# Altium schematic sheet Sheet1.SchDoc
size 209 x 297 mm; Scale: 1:1; DocumentType: Схема электрическая принципиальная; FirstReferrence: АБВГ.123456.001
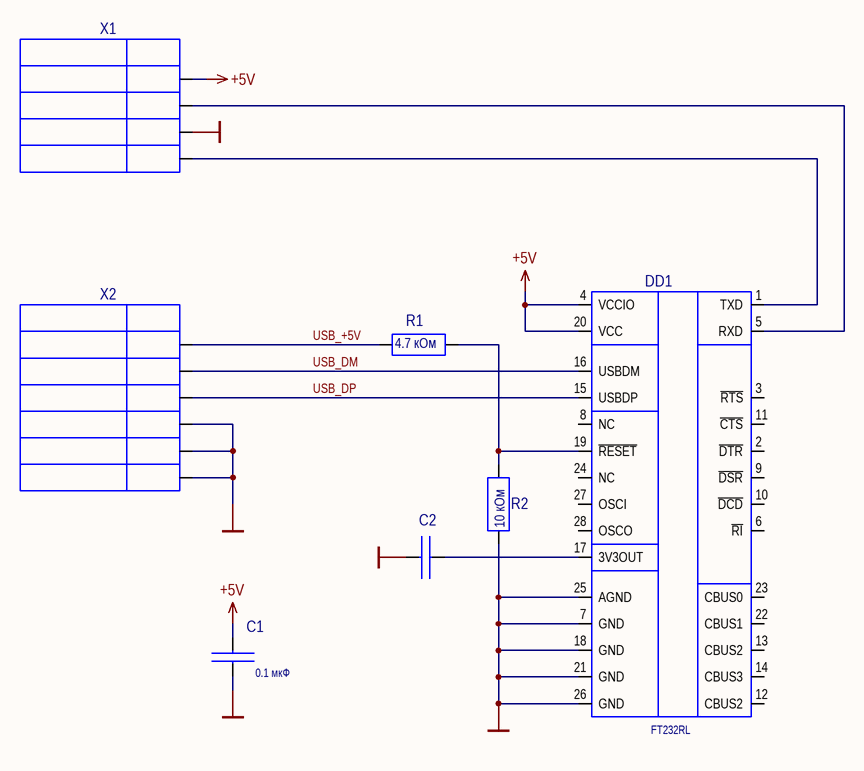
[diagram p0: Sheet1.SchDoc]

## Parts
C1  value 0.1 мкФ  [C0805]  (hidden comment: C_2)
C2  C_2  [C0805]  (value not drawn)
DD1  FT232RL  [SSOP28-LD]
R1  value 4.7 кОм  [C0805]  (hidden comment: R_1)
R2  value 10 кОм  [C0805]  (hidden comment: R_1)
X1  PLS4  [HDR1X4]  (value not drawn)
X2  USB Type B  [USB Type B]  (value not drawn)

## Nets
+5V: C1.1 DD1.4(VCCIO) DD1.20(VCC) X1.1
GND: C1.2 C2.2 DD1.7(GND) DD1.18(GND) DD1.21(GND) DD1.25(AGND) DD1.26(GND) R2.2 X1.3 X2.4 X2.5 X2.6
USB_+5V: R1.1 X2.1
USB_DM: DD1.16(USBDM) X2.2
USB_DP: DD1.15(USBDP) X2.3
NetC2_1: C2.1 DD1.17(3V3OUT)
NetDD1_1: DD1.1(TXD) X1.4
NetDD1_5: DD1.5(RXD) X1.2
NetDD1_19: DD1.19(~{RESET}) R1.2 R2.1

Not connected (* = marked no-connect by the designer): DD1 2(~{DTR}) 3(~{RTS}) 6(~{RI}) 8(NC) 9(~{DSR}) 10(~{DCD}) 11(~{CTS}) 12(CBUS2) 13(CBUS2) 14(CBUS3) 22(CBUS1) 23(CBUS0) 24(NC) 27(OSCI) 28(OSCO)

## Notes on the sheet
- Перв. примен.
- Справ. №
- Подп. и дата
- Инв. № дубл.
- Взам. инв. №
- Разраб.
- Изм.
- Лист
- № докум.
- Подп.
- Дата
- Лит.
- Масса
- Масштаб
- Пров.
- Т.контр.
- Листов
- Инв. № подл.
- Утв.
- Н.контр.
- 2.106-A4
- Копировал
- Формат А4

## Library data of the parts
C1 = C_2: Name: X7R, 0805; Power/Voltage: 50В; Tolerance: 5%; Type: Конденсатор; BCDId: *; ManufacturerPartNumber: *; Rem: *; TKE/TCK: *; TU/GOST: *; ValueBOM: *
C2 = C_2: Manufacturer: ф. Kemet; Name: X7R, 0805; Power/Voltage: 50В; Tolerance: 5%; Type: Конденсатор; Value: 0.1 мкФ; BCDId: *; ManufacturerPartNumber: *; Rem: *; TKE/TCK: *; TU/GOST: *; ValueBOM: *
DD1 = FT232RL: Manufacturer: ф. FTDI; BCDId: *; ManufacturerPartNumber: FT232RL; TU/GOST: *; Type: Микросхема; ValueBOM: *
R1 R2 = R_1: Name: 0805; Tolerance: 5%; BCDId: *; Manufacturer: *; ManufacturerPartNumber: *; Power/Voltage: *; Rem: *; TKE/TCK: *; TU/GOST: *; Type: Резистор; ValueBOM: *
X1 = PLS4: Manufacturer: ф. Ningbo Zhenqin Electronic; BCDId: *; ManufacturerPartNumber: PLS4; TU/GOST: *; Type: Разъём; ValueBOM: *
X2 = USB Type B: BCDId: *; ManufacturerPartNumber: USB Type B; TU/GOST: *; Type: Разъём; ValueBOM: *